# Altium project project.PrjPcb
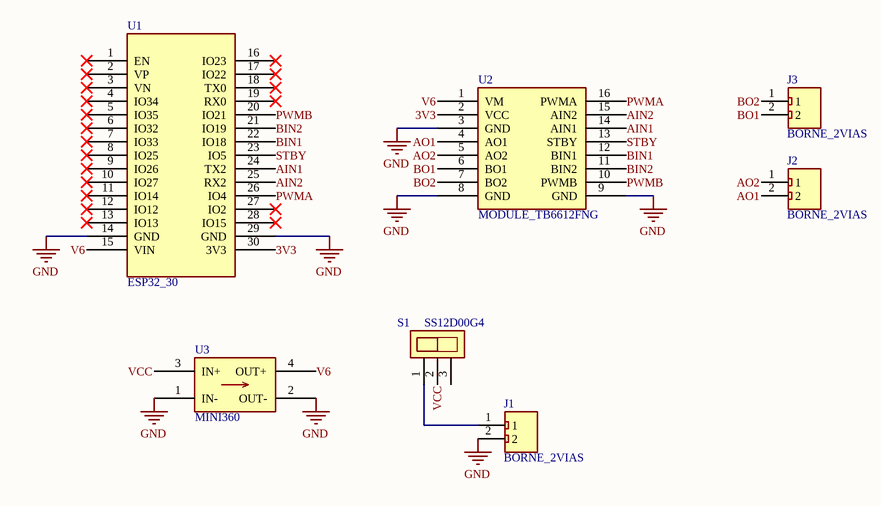
[diagram p0: schematic.SchDoc]
1 sheet, 7 parts. Net scope: global (net labels, ports and power ports of the same name join across sheets).
Board file: pcb.PcbDoc

## Sheet schematic.SchDoc
size A4; SheetNumber: 1; SheetTotal: 1

### Parts
J1  BORNE_2VIAS  [BORNE_2_VIAS]
J2  BORNE_2VIAS  [BORNE_2_VIAS]
J3  BORNE_2VIAS  [BORNE_2_VIAS]
S1  SS12D00G4  [SS12D00G4]
U1  ESP32_30  [ESP32_30]
U2  MODULE_TB6612FNG  [MODULE_TB6612FNG]
U3  MINI360  [MINI360]

### Nets
GND: J1.2 U1.14(GND) U1.29(GND) U2.3(GND) U2.8(GND) U2.9(GND) U3.1(IN-) U3.2(OUT-)
3V3: U1.30(3V3) U2.2(VCC)
AIN1: U1.24(TX2) U2.14(AIN1)
AIN2: U1.25(RX2) U2.15(AIN2)
AO1: J2.2 U2.4(AO1)
AO2: J2.1 U2.5(AO2)
BIN1: U1.22(IO18) U2.12(BIN1)
BIN2: U1.21(IO19) U2.11(BIN2)
BO1: J3.2 U2.6(BO1)
BO2: J3.1 U2.7(BO2)
PWMA: U1.26(IO4) U2.16(PWMA)
PWMB: U1.20(IO21) U2.10(PWMB)
STBY: U1.23(IO5) U2.13(STBY)
V6: U1.15(VIN) U2.1(VM) U3.4(OUT+)
VCC: S1.2 U3.3(IN+)
NetJ1_1: J1.1 S1.1

Not connected (* = marked no-connect by the designer): S1 3; U1 1(EN)* 2(VP)* 3(VN)* 4(IO34)* 5(IO35)* 6(IO32)* 7(IO33)* 8(IO25)* 9(IO26)* 10(IO27)* 11(IO14)* 12(IO12)* 13(IO13)* 16(IO23)* 17(IO22)* 18(TX0)* 19(RX0)* 27(IO2)* 28(IO15)*

### Library data of the parts
U1 = ESP32_30: Microcontoller Board 30 Pins Wifi 2.4GHz BLE 4.2 ESP32-WROOM-32D; ComponentLink1Description: Datasheet; ComponentLink1URL: https://www.mouser.com/datasheet/2/891/esp32_wroom_32d_esp32_wroom_32u_datasheet_en-1365844.pdf
U2 = MODULE_TB6612FNG: Module Dual Motor Driver 2.5-13.5V 3.2A Peak 21x18mm; ComponentLink1Description: Datasheet; ComponentLink1URL: https://www.mouser.com/datasheet/2/408/TB6612FNG_datasheet_en_20141001-708260.pdf
U3 = MINI360: MODULE BUCK STEP DOWN 3A 18x12mm; ComponentLink1Description: Datasheet; ComponentLink1URL: https://cdn-shop.adafruit.com/datasheets/MP2307_r1.9.pdf